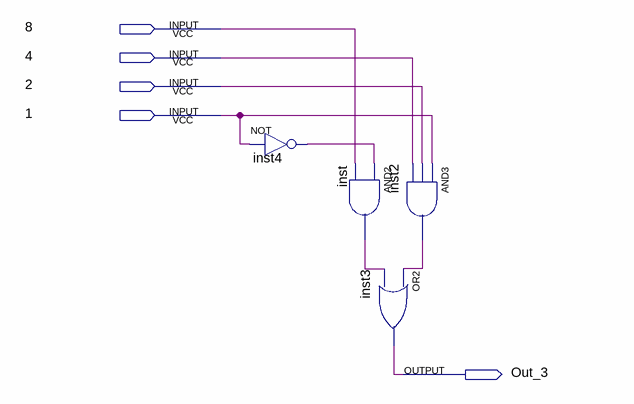
[diagram p0: schematic sheet]
// Quartus schematic D3.bdf as structural Verilog: 4 symbols, 5 pins
module D3 (
  input  \8 ,
  input  \4 ,
  input  \2 ,
  input  \1 ,
  output Out_3
);

  wire inst2_out, inst4_out, inst_out;

  not inst4 (inst4_out, \1 );
  and inst (inst_out, inst4_out, \8 );
  and inst2 (inst2_out, \1 , \2 , \4 );
  or inst3 (Out_3, inst2_out, inst_out);
endmodule
